# EAGLE design KIS_3R33S_vreg (EAGLE 6.5.0)
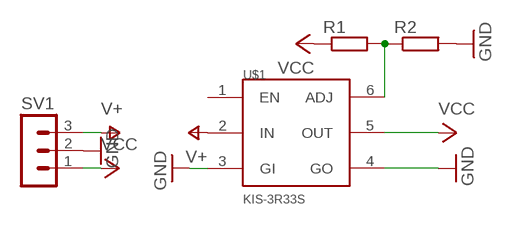
[diagram p0: schematic, sheet 1]

## Parts
R1  R-EU_R1206W  [R1206W]
R2  R-EU_R1206W  [R1206W]
SV1  MA03-1  [MA03-1]
U$1  KIS-3R33S  [KIS-3R33S]

## Nets
GND: R2.2 SV1.2 U$1.3(GI) U$1.4(GO)
N$1: R1.2 R2.1 U$1.6(ADJ)
V+: SV1.3 U$1.2(IN)
VCC: R1.1 SV1.1 U$1.5(OUT)
Unconnected: U$1.1(EN)

## Library data of the parts
R1 R2 = rcl:R-EU_: RESISTOR, European symbol
SV1 = con-lstb:MA03-1: PIN HEADER; OC_FARNELL: unknown; OC_NEWARK: unknown
U$1 = KIS-3R33S:KIS-3R33S: DC-DC Converter

## Board
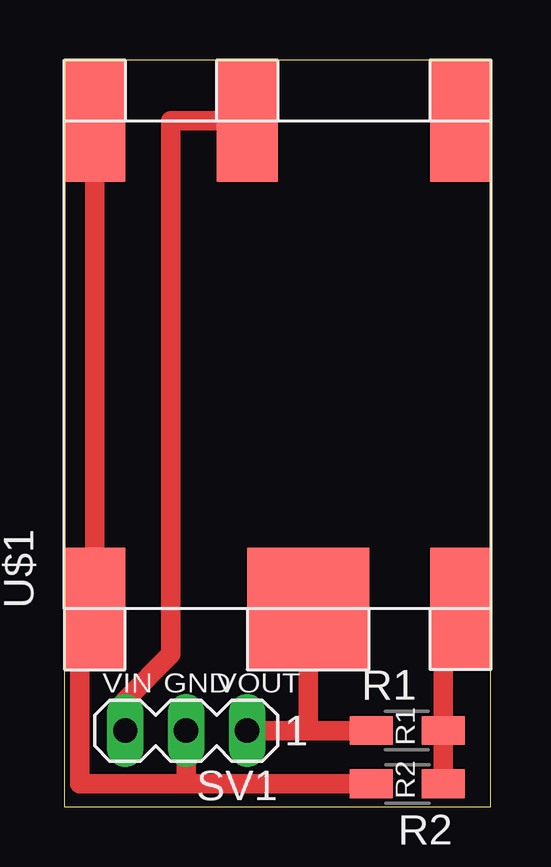
[diagram p1: board, top side]

Size 17.77 x 31.11 mm. Coordinates in mm from the lower left corner, seen from the top.
Outline: 0,0 17.77,0 17.77,31.11 0,31.11 0,0
Copper layers (1*16): Top 0.035mm / dielectric 1.5mm / Bottom 0.035mm
Design rules "default": minimum track width 10mil, minimum drill 24mil, track to track 8mil, track to pad 8mil, pad to pad 8mil, via to via 8mil, smd to smd 8mil, copper to edge 40mil, drill to drill 8mil, minimum pad ring 10mil, minimum via ring 8mil, stop-mask expansion 4mil, vias tented up to drill 0mil, thermal gap 10mil

### Footprints (pad centres in the part's own frame; a part is rotated, then mirrored left to right if it is on the bottom)
R1206W = smd 1.8 x 1.2: 1 -1.499,0; 2 1.499,0
MA03-1 = drill 1.016 long: 1 -2.54,0; 2 0,0; 3 2.54,0
KIS-3R33S = smd 5.08 x 2.54: 1 10.16,-7.62; 2 10.16,1.27; 3 10.16,7.62; 4 -10.16,7.62; 6 -10.16,-7.62 | smd 5.08 x 5.08: 5 -10.16,-1.27

### Placement (x,y rotation side)
R1  14.29,3.17 0 top
R2  14.29,0.95 180 top
SV1  5.08,3.17 180 top
U$1  8.89,18.41 90 top

### Tracks (layer width: path | path; a pad name or v marks a point on that pad's centre or on a via)
GND
  Top 0.813: U$1.3 U$1.4 0.64,8.26 0.64,0.95 5.08,0.95 | 5.08,0.95 R2.2 | SV1.2 5.08,0.95
N$1
  Top 0.813: 16.74,8.26 U$1.6 15.79,8.26 R1.2 R2.1
V+
  Top 0.813: U$1.2 4.45,28.57 4.45,6.35 2.54,4.45 SV1.3
VCC
  Top 0.813: R1.1 10.16,3.17 | 10.16,3.17 U$1.5 | SV1.1 10.16,3.17

### Text on the board
_tsilk: VIN | GND | VOUT | R1 | R2
_bsilk: Gobotics Ltd | 78BXX | Use R1 OR R2. / 1.8V - R1 - 11K / 2.4V - R1 - 39K / 3.0V - R1 - 180K / 3.3V - No Resistors / 4.2V - R2 - 22K / 5.0V - R2 - 10K / 7.0V - R2 - 3.3K / 9.0V - R2 - 820R / 10V - R2 - 220R